# Altium project SpeakEasy_Audio.PrjPcb
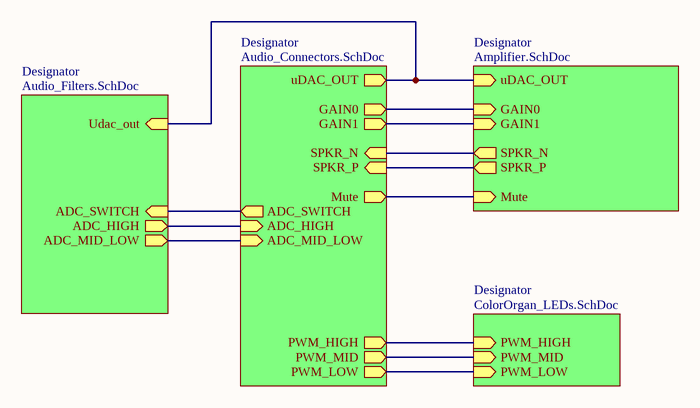
[diagram p0: SpeakEasy_Audio.SchDoc]
5 sheets, 104 parts. Net scope: hierarchical (ports join the sheet entries above them; power ports are global).
Board file: SpeakEasy_Audio.PcbDoc
Sheets:
  SpeakEasy_Audio.SchDoc
    Designator = Audio_Connectors.SchDoc
    Designator = Amplifier.SchDoc
    Designator = ColorOrgan_LEDs.SchDoc
    Designator = Audio_Filters.SchDoc

## Sheet SpeakEasy_Audio.SchDoc
size A

### Sub-sheets
Designator = Audio_Connectors.SchDoc: uDAC_OUT (out), SPKR_N (in), SPKR_P (in), PWM_LOW (out), PWM_HIGH (out), PWM_MID (out), GAIN1 (out), GAIN0 (out), Mute (out), ADC_SWITCH (out), ADC_HIGH (in), ADC_MID_LOW (in)
Designator = Amplifier.SchDoc: SPKR_P (out), uDAC_OUT (in), SPKR_N (out), GAIN0 (in), GAIN1 (in), Mute (in)
Designator = ColorOrgan_LEDs.SchDoc: PWM_MID (in), PWM_LOW (in), PWM_HIGH (in)
Designator = Audio_Filters.SchDoc: Udac_out (in), ADC_SWITCH (in), ADC_HIGH (out), ADC_MID_LOW (out)

### Nets
ADC_HIGH: sheet Designator/ADC_HIGH, sheet Designator/ADC_HIGH
ADC_HIGH_MID: sheet Designator/ADC_MID_LOW, sheet Designator/ADC_MID_LOW
ADC_SWITCH: sheet Designator/ADC_SWITCH, sheet Designator/ADC_SWITCH
GAIN0: sheet Designator/GAIN0, sheet Designator/GAIN0
GAIN1: sheet Designator/GAIN1, sheet Designator/GAIN1
Mute: sheet Designator/Mute, sheet Designator/Mute
PWM_HIGH: sheet Designator/PWM_HIGH, sheet Designator/PWM_HIGH
PWM_LOW: sheet Designator/PWM_LOW, sheet Designator/PWM_LOW
PWM_MID: sheet Designator/PWM_MID, sheet Designator/PWM_MID
SPKR_N: sheet Designator/SPKR_N, sheet Designator/SPKR_N
SPKR_P: sheet Designator/SPKR_P, sheet Designator/SPKR_P
uDAC_OUT: sheet Designator/uDAC_OUT, sheet Designator/uDAC_OUT, sheet Designator/Udac_out

## Sheet Audio_Connectors.SchDoc
size A
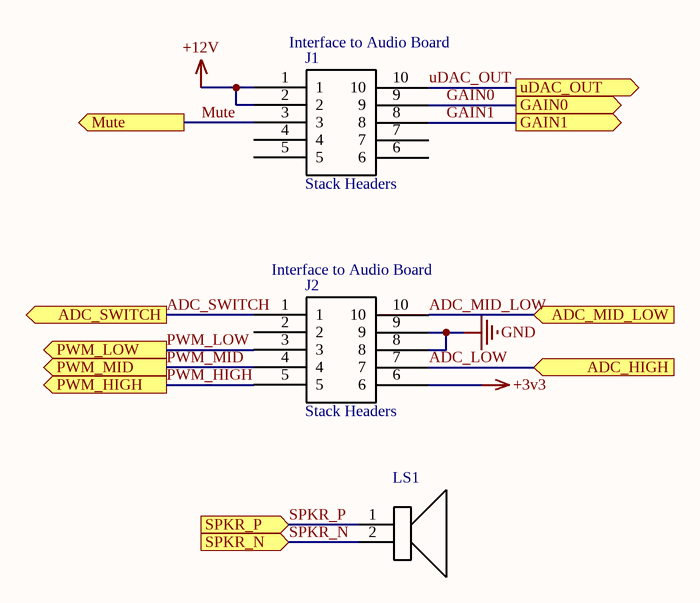
[diagram p1: Audio_Connectors.SchDoc]

### Parts
J1  Stack Headers  [SSW-105]
J2  Stack Headers  [SSW-105]
LS1  Made for use with 20AWG  [Speaker]  (value not drawn)

### Ports
ADC_HIGH (in), ADC_MID_LOW (in), ADC_SWITCH (out), GAIN0 (out), GAIN1 (out), Mute (out), PWM_HIGH (out), PWM_LOW (out), PWM_MID (out), SPKR_N (in), SPKR_P (in), uDAC_OUT (out)

### Nets
+3v3: J2.6
+12V: J1.1 J1.2
GND: J2.8 J2.9
ADC_LOW: J2.7 ; port ADC_HIGH  [project net ADC_HIGH]
ADC_MID_LOW: J2.10 ; port ADC_MID_LOW  [project net ADC_HIGH_MID]
ADC_SWITCH: J2.1 ; port ADC_SWITCH
GAIN0: J1.9 ; port GAIN0
GAIN1: J1.8 ; port GAIN1
Mute: J1.3 ; port Mute
PWM_HIGH: J2.5 ; port PWM_HIGH
PWM_LOW: J2.3 ; port PWM_LOW
PWM_MID: J2.4 ; port PWM_MID
SPKR_N: LS1.2 ; port SPKR_N
SPKR_P: LS1.1 ; port SPKR_P
uDAC_OUT: J1.10 ; port uDAC_OUT

Not connected (* = marked no-connect by the designer): J1 4 5 6 7; J2 2

### Notes on the sheet
- (near J1) Interface to Audio Board
- (near J2) Interface to Audio Board

### Library data of the parts
J1 J2 = Stack Headers: System: Connector
LS1 = Speaker_Footprint

## Sheet Amplifier.SchDoc
size A
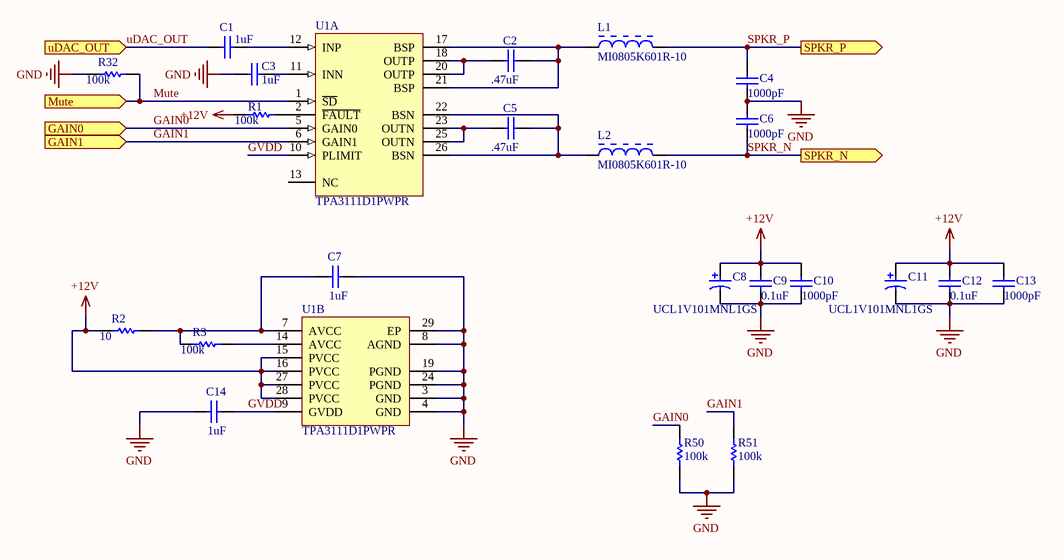
[diagram p2: Amplifier.SchDoc]

### Parts
C1  1uF  [CAPC0603(1608)100_L]
C2  .47uF  [CAPC0805(2012)110_N]
C3  1uF  [CAPC0603(1608)100_L]
C4  1000pF  [CAPC0805(2012)145_L]
C5  .47uF  [CAPC0805(2012)110_N]
C6  1000pF  [CAPC0805(2012)145_L]
C7  1uF  [CAPC0603(1608)100_L]
C8  UCL1V101MNL1GS  [NIC-UCL1V101MNL1GS_L]
C9  0.1uF  [CAPC0805(2012)145_L]
C10  1000pF  [CAPC0805(2012)145_L]
C11  UCL1V101MNL1GS  [NIC-UCL1V101MNL1GS_L]
C12  0.1uF  [CAPC0805(2012)145_L]
C13  1000pF  [CAPC0805(2012)145_L]
C14  1uF  [CAPC0603(1608)100_L]
L1  MI0805K601R-10  [LIRD-MI0805K601R-10-2_V]
L2  MI0805K601R-10  [LIRD-MI0805K601R-10-2_V]
R1  100K  [RESC0805(2012)_L]
R2  value 10  [RESC0805(2012)_L]  (hidden comment: 10R)
R3  100k  [RESC0805(2012)_L]
R32  100K  [RESC0805(2012)_L]
R50  100K  [RESC0805(2012)_L]
R51  100K  [RESC0805(2012)_L]
U1  TPA3111D1PWPR  [TI-PWP28-5720X1950TP_Q]  (parts A,B of 2)

### Ports
GAIN0 (in), GAIN1 (in), Mute (in), SPKR_N (out), SPKR_P (out), uDAC_OUT (in)

### Nets
+12V: C8.1 C9.2 C10.2 C11.1 C12.2 C13.2 R1.1 R2.1 U1.15(PVCC) U1.16(PVCC) U1.27(PVCC) U1.28(PVCC)
GND: C3.1 C4.1 C6.2 C7.2 C8.2 C9.1 C10.1 C11.2 C12.1 C13.1 C14.1 R32.1 R50.1 R51.1 U1.3(GND) U1.4(GND) U1.8(AGND) U1.19(PGND) U1.24(PGND) U1.29(EP)
GAIN0: R50.2 U1.5(GAIN0) ; port GAIN0
GAIN1: R51.2 U1.6(GAIN1) ; port GAIN1
GVDD: C14.2 U1.9(GVDD) U1.10(PLIMIT)
Mute: R32.2 U1.1(~{SD}) ; port Mute
SPKR_N: C6.1 L2.2 ; port SPKR_N
SPKR_P: C4.2 L1.2 ; port SPKR_P
uDAC_OUT: C1.1 ; port uDAC_OUT
NetC1_2: C1.2 U1.12(INP)
NetC2_1: C2.1 U1.18(OUTP) U1.20(OUTP)
NetC2_2: C2.2 L1.1 U1.17(BSP) U1.21(BSP)
NetC3_2: C3.2 U1.11(INN)
NetC5_1: C5.1 U1.23(OUTN) U1.25(OUTN)
NetC5_2: C5.2 L2.1 U1.22(BSN) U1.26(BSN)
NetC7_1: C7.1 R2.2 R3.1 U1.7(AVCC)
NetR1_2: R1.2 U1.2(~{FAULT})
NetR3_2: R3.2 U1.14(AVCC)

Not connected (* = marked no-connect by the designer): U1 13(NC)

### Library data of the parts
C1 C3 C7 C14 = CMP-1035-02740-1: CAP 1uF 25V ±10% 0603 (1608 Metric) Thickness 1mm SMD; Tolerance: Â±10%; Case-Metric: 1608; Case-EIA: 0603; Technology: SMT; Rated Voltage: 25 V; Max Thickness: 1 mm; Value: 1uF
C2 C5 = CMP-1036-04655-1: CAP 470nF 50V ±20% 0805 (2012 Metric) Thickness 1.1mm SMD; Case-Metric: 2012; Case-EIA: 0805; Tolerance: Â±20%; Max Thickness: 1.1 mm; Value: 470nF; Technology: SMT; Rated Voltage: 50 V
C4 C6 C9 C10 C12 C13 = CMP-1590-00003-1: 0805 (2012 Metric) Chip Capacitor; Case-EIA: 0805; Case-Metric: 2012; PackageReference: CAPC0805(2012)145
C8 C11 = CMP-2000-07344-1: Aluminum Electrolytic Capacitor, 100 uF, 35 V, 20%, -55 to 105 degC, 2-Pin SMD, RoHS, Tape and Reel; Manufacturer: Nichicon; Capacitance: 100uF; Dissipation Factor DF: 0.12; Case Diameter: 8mm; Ripple Current: 850mA; Type: AluminumElectrolyticCapacitors,ChipType,LowImpedance; Case Height: 8.3mm; Leakage Current: 3uA; Voltage Rating DC: 35V; Load Life: 2000h; Case Length: 10mm; Series: CL; Minimum Operating Temperature: -55C; Datasheet URL: http://datasheet.octopart.com/UCL1V101MNL1GS-Nichicon-datasheet-41194108.pdf; Manufacturer URL: http://www.nichicon.co.jp/english/; Maximum Operating Temperature: +105C; Package Reference: UCL1V101MNL1GS; Operating Temperature Range: -55Cto+105C; Brand: Nichicon; Package Description: 2-Pin Surface Mount Device, Body 8.3 x 8.3 mm, Height 10.8 mm; RoHS: Details; Voltage Rating: 35V; Dimensions: 8mmDia.x10mmLx8.3mmH; Termination Style: SMD/SMT; Datasheet Version: 01/2015; Packaging: Reel; Mounting Technology: SurfaceMount; Product Category: AluminumElectrolyticCapacitors-SMD; Factory Pack Quantity: 500; Product: LowImpedanceElectrolyticCapacitors; Tolerance: 20%
L1 L2 = CMP-2000-05196-1: Chip Bead for Power Filtering, 1500 mA, 600 Ohm, -40 to 125 degC, 0805 (2012 Metric), RoHS, Tape and Reel; Manufacturer: Laird; Filter Type: PowerLine; Current Rating (Max): 1.5A; Catalog Drawings: (HI,HZ,LI,MI)0805Series_1.10mmMax.Height; Impedance @ Frequency: 600Ohm@100MHz; Number of Lines: 1; DC Resistance (DCR) (Max): 100mOhm; Other Names: 240-2390-1; Kits: 240-2227-ND-KITEMIFERRITEBEADCHIPSMD; Online Catalog: MISeries; Standard Package: 1; Datasheet Version: Rev. A, 01/2004; Height (Max): 0.043"(1.10mm); Category: Filters; Operating Temperature: -40degC~125degC; Package Description: 2-Pin Surface Mount Device, Body 2 x 1.25 mm; Package / Case: 0805(2012Metric); Package Reference: MI0805K601R-10-2; Packaging: CutTape(CT); Ratings: -; Mounting Type: SurfaceMount; Datasheet URL: https://datasheet.ciiva.com/3082/mi0805k601r-10-a-vp-3082219.pdf; Size / Dimension: 0.079"Lx0.049"W(2.00mmx1.25mm); Family: FerriteBeadsandChips; Manufacturer URL: https://www.lairdtech.com; Series: MI
R1-R3 R32 R50 R51 = CMP-1591-00002-1: 0805 (2012 Metric) Chip Resistor; Case-EIA: 0805; Case-Metric: 2012; PackageReference: RESC0805(2012)
  R1 R3 R32 R50 R51: Value: 100k
U1 = CMP-0994-00250-1: 10 W Mono Class-D Audio Power Amplifier with SpeakerGuard(TM), -40 to 85 degC, 28-pin SOP (PWP28), Green (RoHS & no Sb/Br); Manufacturer: Texas Instruments; Input Type: Analog; Max. Number of Speaker Outputs: 1; Analog Supply Max [V]: 26; Analog Supply Min [V]: 8; SubFamily: Mid/High-Power Amplifier; ComponentLink1URL: http://www.ti.com/; DatasheetVersion: SLOS618C; ComponentLink2URL: http://www.ti.com/general/docs/lit/getliterature.tsp?genericPartNumber=TPA3111D1&fileType=pdf; ComponentLink1Description: Manufacturer URL; Code_JEDEC: MO-153; ComponentLink2Description: Datasheet; Eco-Plan: Green (RoHS & no Sb/Br); ComponentLink3URL: http://www.ti.com/litv/pdf/mpds373; PackageDescription: 28-Pin Plastic Small Outline, Body 4.4 x 9.7 mm, Pitch 0.65 mm; Power Stage Supply Min(V): 8; PackageVersion: 4073225-6/I, 05/2011; Mounting Technology: Surface Mount; PartNumber: TPA3111D1PWPR; PackageReference: PWP28-5720X1950TP; ComponentLink3Description: Package Specification

## Sheet ColorOrgan_LEDs.SchDoc
size A
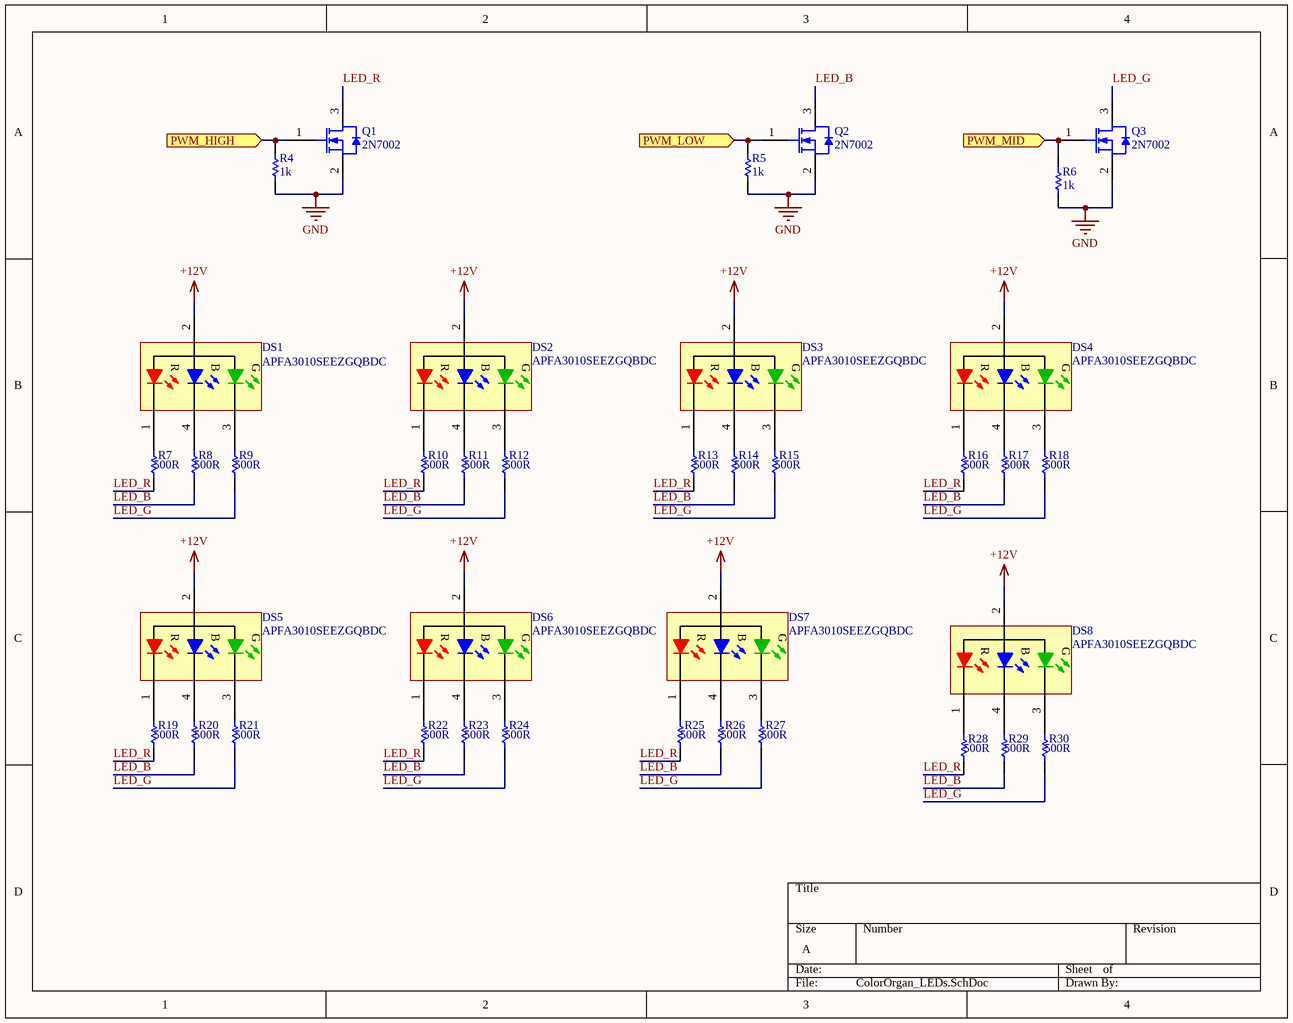
[diagram p3: ColorOrgan_LEDs.SchDoc]

### Parts
DS1  APFA3010SEEZGQBDC  [KING-APFA3010SEEZGQBDC-4_V]
DS2  APFA3010SEEZGQBDC  [KING-APFA3010SEEZGQBDC-4_V]
DS3  APFA3010SEEZGQBDC  [KING-APFA3010SEEZGQBDC-4_V]
DS4  APFA3010SEEZGQBDC  [KING-APFA3010SEEZGQBDC-4_V]
DS5  APFA3010SEEZGQBDC  [KING-APFA3010SEEZGQBDC-4_V]
DS6  APFA3010SEEZGQBDC  [KING-APFA3010SEEZGQBDC-4_V]
DS7  APFA3010SEEZGQBDC  [KING-APFA3010SEEZGQBDC-4_V]
DS8  APFA3010SEEZGQBDC  [KING-APFA3010SEEZGQBDC-4_V]
Q1  2N7002  [STM-SOT-23-3_V]
Q2  2N7002  [STM-SOT-23-3_V]
Q3  2N7002  [STM-SOT-23-3_V]
R4  1k  [RESC0805(2012)_L]
R5  1k  [RESC0805(2012)_L]
R6  1k  [RESC0805(2012)_L]
R7  500R  [RESC0805(2012)_L]
R8  500R  [RESC0805(2012)_L]
R9  500R  [RESC0805(2012)_L]
R10  500R  [RESC0805(2012)_L]
R11  500R  [RESC0805(2012)_L]
R12  500R  [RESC0805(2012)_L]
R13  500R  [RESC0805(2012)_L]
R14  500R  [RESC0805(2012)_L]
R15  500R  [RESC0805(2012)_L]
R16  500R  [RESC0805(2012)_L]
R17  500R  [RESC0805(2012)_L]
R18  500R  [RESC0805(2012)_L]
R19  500R  [RESC0805(2012)_L]
R20  500R  [RESC0805(2012)_L]
R21  500R  [RESC0805(2012)_L]
R22  500R  [RESC0805(2012)_L]
R23  500R  [RESC0805(2012)_L]
R24  500R  [RESC0805(2012)_L]
R25  500R  [RESC0805(2012)_L]
R26  500R  [RESC0805(2012)_L]
R27  500R  [RESC0805(2012)_L]
R28  500R  [RESC0805(2012)_L]
R29  500R  [RESC0805(2012)_L]
R30  500R  [RESC0805(2012)_L]

### Ports
PWM_HIGH (in), PWM_LOW (in), PWM_MID (in)

### Nets
+12V: DS1.2(A) DS2.2(A) DS3.2(A) DS4.2(A) DS5.2(A) DS6.2(A) DS7.2(A) DS8.2(A)
GND: Q1.2(S) Q2.2(S) Q3.2(S) R4.1 R5.1 R6.1
LED_B: Q2.3(D) R8.1 R11.1 R14.1 R17.1 R20.1 R23.1 R26.1 R29.1
LED_G: Q3.3(D) R9.1 R12.1 R15.1 R18.1 R21.1 R24.1 R27.1 R30.1
LED_R: Q1.3(D) R7.1 R10.1 R13.1 R16.1 R19.1 R22.1 R25.1 R28.1
PWM_HIGH: Q1.1(G) R4.2 ; port PWM_HIGH
PWM_LOW: Q2.1(G) R5.2 ; port PWM_LOW
PWM_MID: Q3.1(G) R6.2 ; port PWM_MID
NetDS1_1: DS1.1(R) R7.2
NetDS1_3: DS1.3(G) R9.2
NetDS1_4: DS1.4(B) R8.2
NetDS2_1: DS2.1(R) R10.2
NetDS2_3: DS2.3(G) R12.2
NetDS2_4: DS2.4(B) R11.2
NetDS3_1: DS3.1(R) R13.2
NetDS3_3: DS3.3(G) R15.2
NetDS3_4: DS3.4(B) R14.2
NetDS4_1: DS4.1(R) R16.2
NetDS4_3: DS4.3(G) R18.2
NetDS4_4: DS4.4(B) R17.2
NetDS5_1: DS5.1(R) R19.2
NetDS5_3: DS5.3(G) R21.2
NetDS5_4: DS5.4(B) R20.2
NetDS6_1: DS6.1(R) R22.2
NetDS6_3: DS6.3(G) R24.2
NetDS6_4: DS6.4(B) R23.2
NetDS7_1: DS7.1(R) R25.2
NetDS7_3: DS7.3(G) R27.2
NetDS7_4: DS7.4(B) R26.2
NetDS8_1: DS8.1(R) R28.2
NetDS8_3: DS8.3(G) R30.2
NetDS8_4: DS8.4(B) R29.2

### Library data of the parts
DS1-DS8 = CMP-1226-00001-1: Right Angle SMD Chip LED Lamp, -40 to 85 degC, 4-Pin SMD, RoHS, Reel; Manufacturer: Kingbright; C(Green): 45 pF Typ.; C(Blue): 100 pF Typ.; C(Red): 25 pF Typ.; IR(Blue): 50 uA Max.; IR(Red): 10 uA Max.; ComponentLink1URL: http://www.kingbright.com/; ComponentLink1Description: Manufacturer URL; DatasheetVersion: Rev. 12B; Operating Temperature Range: -40 to 85 degC; ComponentLink2URL: http://www.kingbrightusa.com/images/catalog/spec/APFA3010SEEZGQBDC.pdf; PackageDescription: 4-Pin Surface Mount Device, Body 3 x 1.5 mm, Height 1 mm; Mounting Technology: Surface Mount; ComponentLink3URL: http://www.kingbrightusa.com/images/catalog/spec/APFA3010SEEZGQBDC.pdf; IR(Green): 50 uA Max.; PartNumber: APFA3010SEEZGQBDC; RoHS: TRUE; ComponentLink3Description: Package Specification; ComponentLink2Description: Datasheet; Packing: Reel
Q1-Q3 = CMP-0434-00001-1: N-channel 60 V, 1.8 Ohm, 0.35 A STripFET(TM) II Power MOSFET, SOT23; Manufacturer: STMicroelectronics; PartNumber: 2N7002; ComponentLink2Description: Datasheet; ComponentLink2URL: http://www.st.com/st-web-ui/static/active/en/resource/technical/document/datasheet/CD00005134.pdf; ComponentLink1Description: Manufacturer URL; ComponentLink1URL: http://www.st.com/; DatasheetVersion: Rev. 9, 11/2008; PackageReference: SOT-23; Mounting Technology: Surface Mount; PackageDescription: 3-Pin SOT23, 3.016 x 2.8 mm Body, 0.95 mm Pitch
R4-R30 = CMP-1591-00002-1: as R1 on sheet Amplifier; PackageReference: RESC0805(2012)
  R7-R30: Value: 500R

## Sheet Audio_Filters.SchDoc
size A
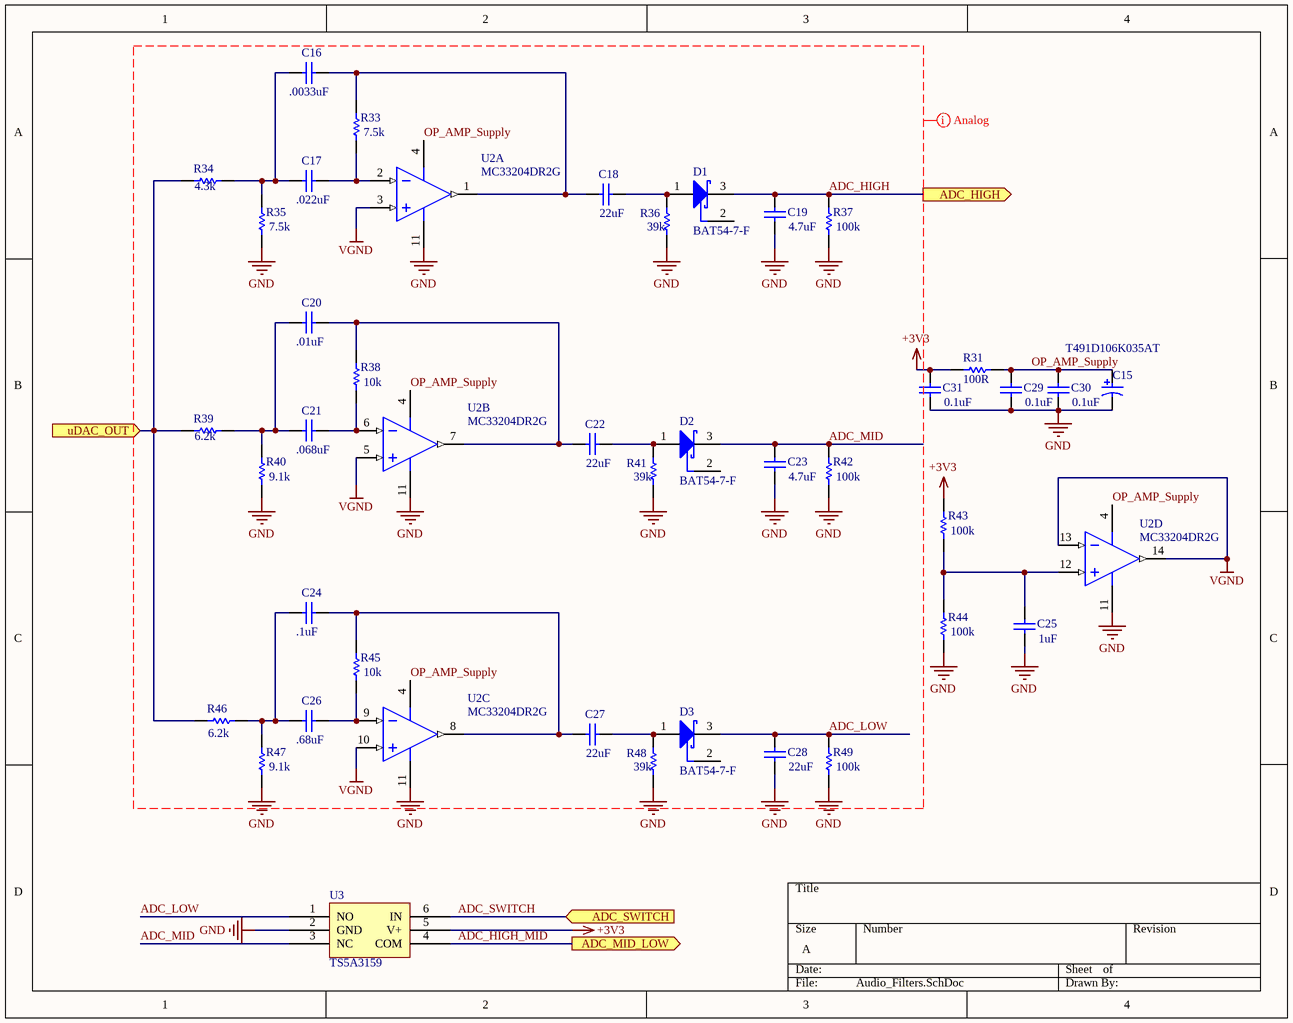
[diagram p4: Audio_Filters.SchDoc]

### Parts
C15  T491D106K035AT  [KEMT-T491-D_L]
C16  value .0033uF  [CAPC0805(2012)145_L]  (hidden comment: CAP0805)
C17  value .022uF  [CAPC0805(2012)145_L]  (hidden comment: CAP0805)
C18  value 22uF  [CAPC0805(2012)145_L]  (hidden comment: CAP0805)
C19  value 4.7uF  [CAPC0805(2012)145_L]  (hidden comment: CAP0805)
C20  value .01uF  [CAPC0805(2012)145_L]  (hidden comment: CAP0805)
C21  value .068uF  [CAPC0805(2012)145_L]  (hidden comment: CAP0805)
C22  value 22uF  [CAPC0805(2012)145_L]  (hidden comment: CAP0805)
C23  value 4.7uF  [CAPC0805(2012)145_L]  (hidden comment: CAP0805)
C24  value .1uF  [CAPC0805(2012)145_L]  (hidden comment: CAP0805)
C25  value 1uF  [CAPC0805(2012)145_L]  (hidden comment: CAP0805)
C26  value .68uF  [CAPC0805(2012)145_L]  (hidden comment: CAP0805)
C27  value 22uF  [CAPC0805(2012)145_L]  (hidden comment: CAP0805)
C28  value 22uF  [CAPC0805(2012)145_L]  (hidden comment: CAP0805)
C29  value 0.1uF  [CAPC0805(2012)145_L]  (hidden comment: CAP0805)
C30  value 0.1uF  [CAPC0805(2012)145_L]  (hidden comment: CAP0805)
C31  value 0.1uF  [CAPC0805(2012)145_L]  (hidden comment: CAP0805)
D1  BAT54-7-F  [DIOD-SOT23-3_V]
D2  BAT54-7-F  [DIOD-SOT23-3_V]
D3  BAT54-7-F  [DIOD-SOT23-3_V]
R31  value 100R  [RESC0805(2012)_L]  (hidden comment: RES0805)
R33  value 7.5k  [RESC0805(2012)_L]  (hidden comment: RES0805)
R34  value 4.3k  [RESC0805(2012)_L]  (hidden comment: RES0805)
R35  value 7.5k  [RESC0805(2012)_L]  (hidden comment: RES0805)
R36  value 39k  [RESC0805(2012)_L]  (hidden comment: RES0805)
R37  value 100k  [RESC0805(2012)_L]  (hidden comment: RES0805)
R38  value 10k  [RESC0805(2012)_L]  (hidden comment: RES0805)
R39  value 6.2k  [RESC0805(2012)_L]  (hidden comment: RES0805)
R40  value 9.1k  [RESC0805(2012)_L]  (hidden comment: RES0805)
R41  value 39k  [RESC0805(2012)_L]  (hidden comment: RES0805)
R42  value 100k  [RESC0805(2012)_L]  (hidden comment: RES0805)
R43  value 100k  [RESC0805(2012)_L]  (hidden comment: RES0805)
R44  value 100k  [RESC0805(2012)_L]  (hidden comment: RES0805)
R45  value 10k  [RESC0805(2012)_L]  (hidden comment: RES0805)
R46  value 6.2k  [RESC0805(2012)_L]  (hidden comment: RES0805)
R47  value 9.1k  [RESC0805(2012)_L]  (hidden comment: RES0805)
R48  value 39k  [RESC0805(2012)_L]  (hidden comment: RES0805)
R49  value 100k  [RESC0805(2012)_L]  (hidden comment: RES0805)
U2  MC33204DR2G  [ONSC-SOIC-14-751A-03_V]  (parts A,B,C,D of 4)
U3  TS5A3159  [SOT95P280X145-6N]

### Ports
ADC_HIGH (out), ADC_MID_LOW (out), ADC_SWITCH (in), uDAC_OUT (in)

### Nets
+3v3: C31.2 R31.2 R43.2 U3.5(V+)
GND: C15.2 C19.1 C23.1 C25.1 C28.1 C29.1 C30.1 C31.1 R35.2 R36.1 R37.1 R40.2 R41.1 R42.1 R44.1 R47.2 R48.1 R49.1 U2.11(VEE) U3.2(GND)
VGND: U2.3(IN1+) U2.5(IN2+) U2.10(IN3+) U2.13(IN4-) U2.14(OUT4)
ADC_HIGH: C19.2 D1.3(K) R37.2 ; port ADC_HIGH
ADC_HIGH_MID: U3.4(COM) ; port ADC_MID_LOW
ADC_LOW: C28.2 D3.3(K) R49.2 U3.1(NO)
ADC_MID: C23.2 D2.3(K) R42.2 U3.3(NC)
ADC_SWITCH: U3.6(IN) ; port ADC_SWITCH
OP_AMP_Supply: C15.1 C29.2 C30.2 R31.1 U2.4(VCC)
uDAC_OUT: R34.1 R39.1 R46.1 ; port uDAC_OUT
NetC16_1: C16.1 C17.1 R34.2 R35.1
NetC16_2: C16.2 C18.1 R33.1 U2.1(OUT1)
NetC17_2: C17.2 R33.2 U2.2(IN1-)
NetC18_2: C18.2 D1.1(A) R36.2
NetC20_1: C20.1 C21.1 R39.2 R40.1
NetC20_2: C20.2 C22.1 R38.1 U2.7(OUT2)
NetC21_2: C21.2 R38.2 U2.6(IN2-)
NetC22_2: C22.2 D2.1(A) R41.2
NetC24_1: C24.1 C26.1 R46.2 R47.1
NetC24_2: C24.2 C27.1 R45.1 U2.8(OUT3)
NetC25_2: C25.2 R43.1 R44.2 U2.12(IN4+)
NetC26_2: C26.2 R45.2 U2.9(IN3-)
NetC27_2: C27.2 D3.1(A) R48.2

Not connected (* = marked no-connect by the designer): D1 2; D2 2; D3 2

### Layout directives
net class Analog: +3V3, ADC_HIGH, ADC_LOW, ADC_MID, GND, OP_AMP_Supply, VGND

### Library data of the parts
C15 = CMP-2000-07580-1: Tantalum Capacitor, 10 uF, +/- 10%, 35 V, -55 to 125 degC, 2-Pin SMD, RoHS, Tape and Reel; Manufacturer: Kemet; Capacitance: 10uF; Leakage Current: 3.5uA; Dissipation Factor: 6%; Case\/Package: 2917; Polarity: Polar; Voltage Rating: 35V; ESR (Equivalent Series Resistance): 1Ohm; Life (Hours): 2000Hour; Tolerance: 20%; Max Operating Temperature: 125degC; Length: 7.3mm; Depth: 4.3mm; Termination: SMD/SMT; Case Code (Metric): 7343; Number of Pins: 2; Package Reference: T491-D; Width: 4.3mm; RoHSCompliant: True; Lead Free: LeadFree; Radiation Hardening: No; Height: 2.8mm; Voltage Rating (DC): 35V; REACH SVHC: NoSVHC; Datasheet URL: http://www.kemet.com/Lists/ProductCatalog/Attachments/254/KEM_T2005_T491.pdf; Datasheet Version: 07/2017; Manufacturer URL: http://www.kemet.com/; Mounting Technology: SurfaceMount; Min Operating Temperature: -55degC; Case Code (Imperial): 2917; Package Quantity: 1; Packaging: TapeandReel; Package Description: 2-Pin Surface Mount Device, Body 7.3 x 4.3 mm; Height - Seated (Max): 0.122inch; Voltage: 35V; Dielectric Material: Tantalum; Mount: PCB
C16-C31 = CMP-1590-00003-1: as C4 on sheet Amplifier; PackageReference: CAPC0805(2012)145
D1-D3 = CMP-0303-00002-1: Schottky Diode, 30V ,200mW, SOT23-3; Manufacturer: Diodes Inc; Forward Current Limit: 200 mA; Reverse Current: 2 uA @25 V; PackageReference: SOT23; ComponentLink3URL: http://www.diodes.com/datasheets/ap02002.pdf; ComponentLink3Description: Package Specification; PartNumber: BAT54-7-F; Storage Temperature: -55 to 150 degC; ComponentLink1Description: Manufacturer URL; Mounting Technology: Surface Mount; ComponentLink2Description: Datasheet; Power Dissipation: 200 mW; PackageVersion: Rev. 73; ComponentLink1URL: http://www.diodes.com/; PackageDescription: 3-Pin SOT23, 3 x 1.4 mm Body, 0.95 mm Pitch; ComponentLink2URL: http://www.diodes.com/datasheets/ds11005.pdf
R31 R33-R49 = CMP-1591-00002-1: as R1 on sheet Amplifier; PackageReference: RESC0805(2012)
U2 = CMP-1310-00192-1: Low Voltage, Rail-to-Rail Operational Amplifier, 1.8 to 12 V, -40 to 105 degC, 14-Pin SOIC, Pb-Free, Tape and Reel; Manufacturer: On Semiconductor; SR Typ (V/uS): 1; GBW Typ (MHz): 2.2; VCC Min (V): 1.8; VCC Max (V): 12; ComponentLink2URL: http://www.onsemi.cn/pub_link/Collateral/MC33201-D.PDF; RoHS: TRUE; DatasheetVersion: Rev. 17; ComponentLink3URL: http://www.onsemi.com/pub_link/Collateral/751A-03.PDF; PackageReference: SOIC-14-751A-03; Packing: Tape and Reel; ComponentLink1Description: Manufacturer URL; ComponentLink3Description: Package Specification; Mounting Technology: Surface Mount; ComponentLink1URL: http://www.onsemi.com/; PartNumber: MC33204DR2G; PackageVersion: Rev. K, 05/2011; PackageDescription: 14-Pin Small Outline Integrated Circuit, Body 8.65 x 3.9 mm, Pitch 1.27 mm; ComponentLink2Description: Datasheet; PartId: 1
U3 = TS5A3159: A 2 to 1 mux for reducing number of ADCs required

## Nets that join several sheets
+3v3: Audio_Connectors (J2.6), Audio_Filters (C31.2 R31.2 R43.2 U3.5)
+12V: Audio_Connectors (J1.1 J1.2), Amplifier (12 pins), ColorOrgan_LEDs (8 pins)
GND: Audio_Connectors (J2.8 J2.9), Amplifier (20 pins), ColorOrgan_LEDs (6 pins), Audio_Filters (20 pins)
ADC_HIGH: Audio_Connectors (J2.7), Audio_Filters (C19.2 D1.3 R37.2)
ADC_HIGH_MID: Audio_Connectors (J2.10), Audio_Filters (U3.4)
ADC_SWITCH: Audio_Connectors (J2.1), Audio_Filters (U3.6)
GAIN0: Audio_Connectors (J1.9), Amplifier (R50.2 U1.5)
GAIN1: Audio_Connectors (J1.8), Amplifier (R51.2 U1.6)
Mute: Audio_Connectors (J1.3), Amplifier (R32.2 U1.1)
PWM_HIGH: Audio_Connectors (J2.5), ColorOrgan_LEDs (Q1.1 R4.2)
PWM_LOW: Audio_Connectors (J2.3), ColorOrgan_LEDs (Q2.1 R5.2)
PWM_MID: Audio_Connectors (J2.4), ColorOrgan_LEDs (Q3.1 R6.2)
SPKR_N: Audio_Connectors (LS1.2), Amplifier (C6.1 L2.2)
SPKR_P: Audio_Connectors (LS1.1), Amplifier (C4.2 L1.2)
uDAC_OUT: Audio_Connectors (J1.10), Amplifier (C1.1), Audio_Filters (R34.1 R39.1 R46.1)